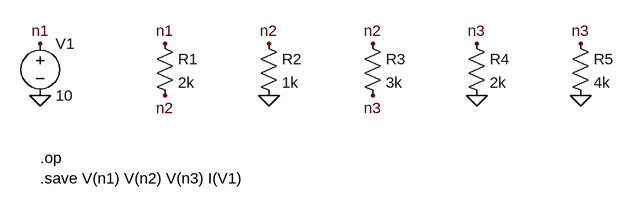
[diagram p0: schematic kirchhoff_nodos.asc]
kirchhoff_nodos.asc, the LTspice schematic file:
Version 4
SHEET 1 1100 760
SYMBOL voltage 48 80 R0
SYMATTR InstName V1
SYMATTR Value 10
SYMBOL res 224 80 R0
SYMATTR InstName R1
SYMATTR Value 2k
SYMBOL res 384 80 R0
SYMATTR InstName R2
SYMATTR Value 1k
SYMBOL res 544 80 R0
SYMATTR InstName R3
SYMATTR Value 3k
SYMBOL res 704 80 R0
SYMATTR InstName R4
SYMATTR Value 2k
SYMBOL res 864 80 R0
SYMATTR InstName R5
SYMATTR Value 4k
FLAG 48 96 n1
FLAG 48 176 0
FLAG 240 96 n1
FLAG 240 176 n2
FLAG 400 96 n2
FLAG 400 176 0
FLAG 560 96 n2
FLAG 560 176 n3
FLAG 720 96 n3
FLAG 720 176 0
FLAG 880 96 n3
FLAG 880 176 0
TEXT 48 272 Left 2 !.op
TEXT 48 304 Left 2 !.save V(n1) V(n2) V(n3) I(V1)

The netlist it stands for:
* kirchhoff_nodos.asc
V1 n1 0 10
R1 n1 n2 2k
R2 n2 0 1k
R3 n2 n3 3k
R4 n3 0 2k
R5 n3 0 4k
.op
.save V(n1) V(n2) V(n3) I(V1)
.backanno
.end